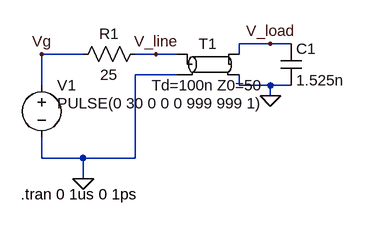
[diagram p0: schematic Draft1.asc]
Draft1.asc, the LTspice schematic file:
Version 4.1
SHEET 1 880 680
WIRE 352 80 304 80
WIRE 384 80 352 80
WIRE 64 96 0 96
WIRE 176 96 144 96
WIRE 208 96 176 96
WIRE 304 96 304 80
WIRE 208 128 144 128
WIRE 0 144 0 96
WIRE 304 144 304 128
WIRE 352 144 304 144
WIRE 384 144 352 144
WIRE 352 160 352 144
WIRE 0 256 0 224
WIRE 64 256 0 256
WIRE 144 256 144 128
WIRE 144 256 64 256
WIRE 64 288 64 256
FLAG 64 288 0
FLAG 352 160 0
FLAG 0 96 Vg
FLAG 176 96 V_line
FLAG 352 80 V_load
SYMBOL voltage 0 128 R0
WINDOW 3 24 44 Left 2
WINDOW 123 0 0 Left 0
WINDOW 39 0 0 Left 0
SYMATTR Value PULSE(0 30 0 0 0 999 999 1)
SYMATTR InstName V1
SYMBOL res 48 112 R270
WINDOW 0 32 56 VTop 2
WINDOW 3 0 56 VBottom 2
SYMATTR InstName R1
SYMATTR Value 25
SYMBOL cap 368 80 R0
SYMATTR InstName C1
SYMATTR Value 1.525n
SYMBOL tline 256 112 R0
SYMATTR InstName T1
SYMATTR Value Td=100n Z0=50
TEXT -32 312 Left 2 !.tran 0 1us 0 1ps

The netlist it stands for:
* Draft1.asc
V1 Vg 0 PULSE(0 30 0 0 0 999 999 1)
R1 Vg V_line 25
C1 V_load 0 1.525n
T1 V_line 0 V_load 0 Td=100n Z0=50
.tran 0 1us 0 1ps
.backanno
.end